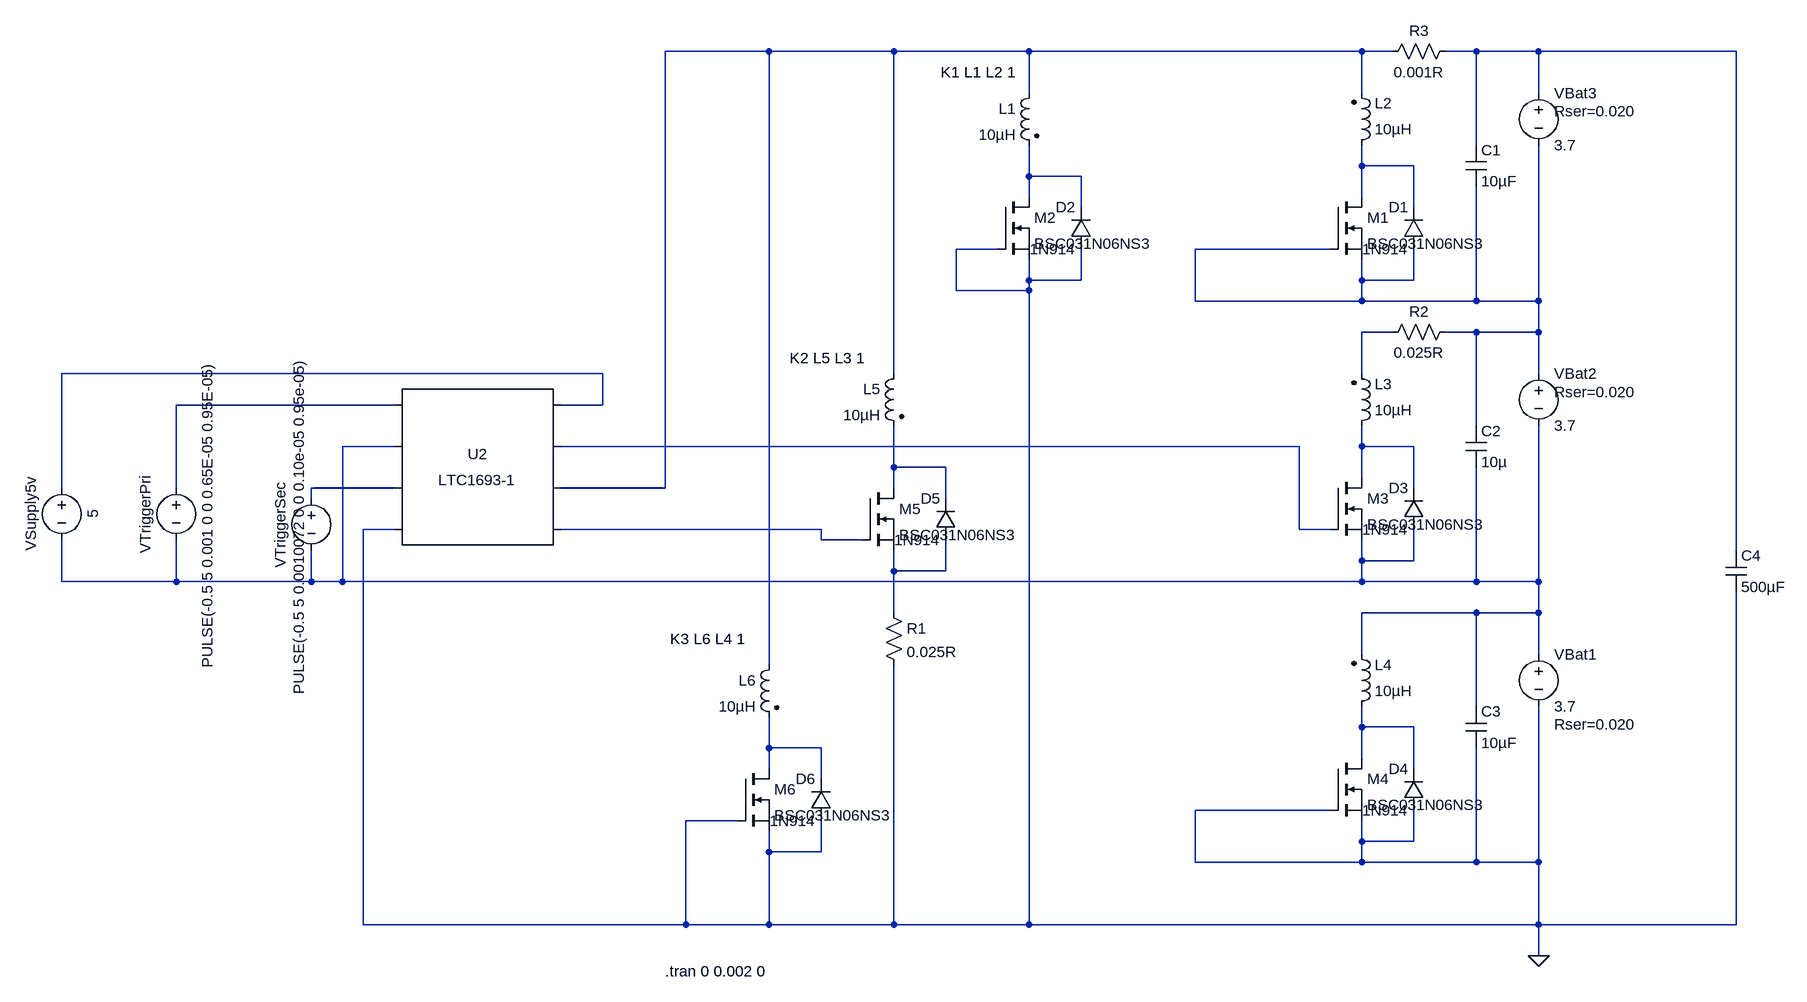
[diagram p0: schematic bms.asc]
bms.asc, the LTspice schematic file:
Version 4
SHEET 1 1480 888
WIRE -768 -672 -928 -672
WIRE -576 -672 -768 -672
WIRE -368 -672 -576 -672
WIRE 144 -672 -368 -672
WIRE 192 -672 144 -672
WIRE 320 -672 272 -672
WIRE 416 -672 320 -672
WIRE 720 -672 416 -672
WIRE -368 -608 -368 -672
WIRE 144 -608 144 -672
WIRE 416 -608 416 -672
WIRE 320 -528 320 -672
WIRE 144 -496 144 -528
WIRE 224 -496 144 -496
WIRE -368 -480 -368 -528
WIRE -288 -480 -368 -480
WIRE -368 -448 -368 -480
WIRE 144 -448 144 -496
WIRE -288 -432 -288 -480
WIRE 224 -432 224 -496
WIRE -416 -368 -480 -368
WIRE 96 -368 -112 -368
WIRE -368 -320 -368 -352
WIRE -288 -320 -288 -368
WIRE -288 -320 -368 -320
WIRE 144 -320 144 -352
WIRE 224 -320 224 -368
WIRE 224 -320 144 -320
WIRE -480 -304 -480 -368
WIRE -368 -304 -368 -320
WIRE -368 -304 -480 -304
WIRE -112 -288 -112 -368
WIRE 144 -288 144 -320
WIRE 144 -288 -112 -288
WIRE 320 -288 320 -464
WIRE 320 -288 144 -288
WIRE 416 -288 416 -528
WIRE 416 -288 320 -288
WIRE 192 -240 144 -240
WIRE 320 -240 272 -240
WIRE 416 -240 416 -288
WIRE 416 -240 320 -240
WIRE -1024 -176 -1856 -176
WIRE -576 -176 -576 -672
WIRE 144 -176 144 -240
WIRE 416 -176 416 -240
WIRE -1344 -128 -1680 -128
WIRE -1024 -128 -1024 -176
WIRE -1024 -128 -1088 -128
WIRE 320 -96 320 -240
WIRE -1344 -64 -1424 -64
WIRE 48 -64 -1088 -64
WIRE 144 -64 144 -96
WIRE 224 -64 144 -64
WIRE -576 -32 -576 -96
WIRE -496 -32 -576 -32
WIRE 144 -16 144 -64
WIRE -1856 0 -1856 -176
WIRE -1680 0 -1680 -128
WIRE -1344 0 -1472 0
WIRE -928 0 -928 -672
WIRE -928 0 -1088 0
WIRE -576 0 -576 -32
WIRE 224 0 224 -64
WIRE -1472 16 -1472 0
WIRE -496 16 -496 -32
WIRE -1344 64 -1392 64
WIRE -688 64 -1088 64
WIRE 48 64 48 -64
WIRE 96 64 48 64
WIRE -688 80 -688 64
WIRE -624 80 -688 80
WIRE 720 96 720 -672
WIRE 144 112 144 80
WIRE 224 112 224 64
WIRE 224 112 144 112
WIRE -576 128 -576 96
WIRE -496 128 -496 80
WIRE -496 128 -576 128
WIRE -1856 144 -1856 80
WIRE -1680 144 -1680 80
WIRE -1680 144 -1856 144
WIRE -1472 144 -1472 96
WIRE -1472 144 -1680 144
WIRE -1424 144 -1424 -64
WIRE -1424 144 -1472 144
WIRE 144 144 144 112
WIRE 144 144 -1424 144
WIRE 320 144 320 -32
WIRE 320 144 144 144
WIRE 416 144 416 -96
WIRE 416 144 320 144
WIRE -576 192 -576 128
WIRE 320 192 144 192
WIRE 416 192 416 144
WIRE 416 192 320 192
WIRE 144 256 144 192
WIRE 416 256 416 192
WIRE -768 272 -768 -672
WIRE 320 336 320 192
WIRE 144 368 144 336
WIRE 224 368 144 368
WIRE -768 400 -768 352
WIRE -688 400 -768 400
WIRE 144 416 144 368
WIRE -768 432 -768 400
WIRE 224 432 224 368
WIRE -688 448 -688 400
WIRE 96 496 -112 496
WIRE -816 512 -896 512
WIRE 144 544 144 512
WIRE 224 544 224 496
WIRE 224 544 144 544
WIRE -768 560 -768 528
WIRE -688 560 -688 512
WIRE -688 560 -768 560
WIRE -112 576 -112 496
WIRE 144 576 144 544
WIRE 144 576 -112 576
WIRE 320 576 320 400
WIRE 320 576 144 576
WIRE 416 576 416 336
WIRE 416 576 320 576
WIRE -1392 672 -1392 64
WIRE -896 672 -896 512
WIRE -896 672 -1392 672
WIRE -768 672 -768 560
WIRE -768 672 -896 672
WIRE -576 672 -576 272
WIRE -576 672 -768 672
WIRE -368 672 -368 -304
WIRE -368 672 -576 672
WIRE 416 672 416 576
WIRE 416 672 -368 672
WIRE 720 672 720 160
WIRE 720 672 416 672
WIRE 416 720 416 672
FLAG 416 720 0
SYMBOL voltage 416 -624 R0
WINDOW 123 0 0 Left 2
WINDOW 39 24 44 Left 2
SYMATTR SpiceLine Rser=0.020
SYMATTR InstName VBat3
SYMATTR Value 3.7
SYMBOL ind2 -352 -624 M0
SYMATTR InstName L1
SYMATTR Value 10µH
SYMATTR Type ind
SYMBOL ind2 128 -512 M180
WINDOW 0 36 80 Left 2
WINDOW 3 36 40 Left 2
SYMATTR InstName L2
SYMATTR Value 10µH
SYMATTR Type ind
SYMBOL nmos 96 -448 R0
SYMATTR InstName M1
SYMATTR Value BSC031N06NS3
SYMBOL diode 240 -368 R180
WINDOW 0 24 64 Left 2
WINDOW 3 24 0 Left 2
SYMATTR InstName D1
SYMATTR Value 1N914
SYMATTR Description Schottky diode
SYMATTR Type schottky
SYMBOL nmos -416 -448 R0
SYMATTR InstName M2
SYMATTR Value BSC031N06NS3
SYMBOL diode -272 -368 R180
WINDOW 0 24 64 Left 2
WINDOW 3 24 0 Left 2
SYMATTR InstName D2
SYMATTR Value 1N914
SYMATTR Description Schottky diode
SYMATTR Type schottky
SYMBOL voltage 416 -192 R0
WINDOW 123 0 0 Left 2
WINDOW 39 24 44 Left 2
SYMATTR SpiceLine Rser=0.020
SYMATTR InstName VBat2
SYMATTR Value 3.7
SYMBOL ind2 128 -80 M180
WINDOW 0 36 80 Left 2
WINDOW 3 36 40 Left 2
SYMATTR InstName L3
SYMATTR Value 10µH
SYMATTR Type ind
SYMBOL nmos 96 -16 R0
SYMATTR InstName M3
SYMATTR Value BSC031N06NS3
SYMBOL diode 240 64 R180
WINDOW 0 24 64 Left 2
WINDOW 3 24 0 Left 2
SYMATTR InstName D3
SYMATTR Value 1N914
SYMATTR Description Schottky diode
SYMATTR Type schottky
SYMBOL voltage 416 240 R0
WINDOW 123 0 0 Left 2
WINDOW 39 24 124 Left 2
SYMATTR SpiceLine Rser=0.020
SYMATTR InstName VBat1
SYMATTR Value 3.7
SYMBOL ind2 128 352 M180
WINDOW 0 36 80 Left 2
WINDOW 3 36 40 Left 2
SYMATTR InstName L4
SYMATTR Value 10µH
SYMATTR Type ind
SYMBOL nmos 96 416 R0
SYMATTR InstName M4
SYMATTR Value BSC031N06NS3
SYMBOL diode 240 496 R180
WINDOW 0 24 64 Left 2
WINDOW 3 24 0 Left 2
SYMATTR InstName D4
SYMATTR Value 1N914
SYMATTR Description Schottky diode
SYMATTR Type schottky
SYMBOL ind2 -560 -192 M0
SYMATTR InstName L5
SYMATTR Value 10µH
SYMATTR Type ind
SYMBOL nmos -624 0 R0
SYMATTR InstName M5
SYMATTR Value BSC031N06NS3
SYMBOL diode -480 80 R180
WINDOW 0 24 64 Left 2
WINDOW 3 24 0 Left 2
SYMATTR InstName D5
SYMATTR Value 1N914
SYMATTR Description Schottky diode
SYMATTR Type schottky
SYMBOL ind2 -752 256 M0
SYMATTR InstName L6
SYMATTR Value 10µH
SYMATTR Type ind
SYMBOL nmos -816 432 R0
SYMATTR InstName M6
SYMATTR Value BSC031N06NS3
SYMBOL diode -672 512 R180
WINDOW 0 24 64 Left 2
WINDOW 3 24 0 Left 2
SYMATTR InstName D6
SYMATTR Value 1N914
SYMATTR Description Schottky diode
SYMATTR Type schottky
SYMBOL cap 304 -528 R0
SYMATTR InstName C1
SYMATTR Value 10µF
SYMBOL cap 304 -96 R0
SYMATTR InstName C2
SYMATTR Value 10µ
SYMATTR SpiceLine V=6.3 Irms=11.832 Rser=0.003 Lser=0
SYMBOL cap 304 336 R0
SYMATTR InstName C3
SYMATTR Value 10µF
SYMBOL voltage -1680 -16 R0
WINDOW 0 -32 56 VBottom 2
WINDOW 3 32 56 VTop 2
WINDOW 123 0 0 Left 2
WINDOW 39 0 0 Left 2
SYMATTR InstName VTriggerPri
SYMATTR Value PULSE(-0.5 5 0.001 0 0 0.65E-05 0.95E-05)
SYMBOL voltage -1472 0 R0
WINDOW 0 -32 56 VBottom 2
WINDOW 3 -4 56 VBottom 2
WINDOW 123 0 0 Left 2
WINDOW 39 0 0 Left 2
SYMATTR InstName VTriggerSec
SYMATTR Value PULSE(-0.5 5 0.0010072 0 0 0.10e-05 0.95e-05)
SYMBOL res -592 176 R0
SYMATTR InstName R1
SYMATTR Value 0.025R
SYMBOL res 288 -256 R90
WINDOW 0 0 56 VBottom 2
WINDOW 3 32 56 VTop 2
SYMATTR InstName R2
SYMATTR Value 0.025R
SYMBOL cap 704 96 R0
SYMATTR InstName C4
SYMATTR Value 500µF
SYMBOL PowerProducts\\LTC1693-1 -1216 -32 R0
SYMATTR InstName U2
SYMBOL voltage -1856 -16 R0
WINDOW 0 -32 56 VBottom 2
WINDOW 3 32 56 VTop 2
WINDOW 123 0 0 Left 2
WINDOW 39 0 0 Left 2
SYMATTR InstName VSupply5v
SYMATTR Value 5
SYMBOL res 176 -656 R270
WINDOW 0 32 56 VTop 2
WINDOW 3 0 56 VBottom 2
SYMATTR InstName R3
SYMATTR Value 0.001R
TEXT -504 -640 Left 2 !K1 L1 L2 1
TEXT -736 -200 Left 2 !K2 L5 L3 1
TEXT -920 232 Left 2 !K3 L6 L4 1
TEXT -928 744 Left 2 !.tran 0 0.002 0

The netlist it stands for:
* bms.asc
VBat3 N002 N005 3.7 Rser=0.020
L1 N001 N004 10µH
L2 N003 N001 10µH
M1 N003 N005 N005 N005 BSC031N06NS3
D1 N005 N003 1N914
M2 N004 0 0 0 BSC031N06NS3
D2 0 N004 1N914
VBat2 N005 N009 3.7 Rser=0.020
L3 N011 N006 10µH
M3 N011 N010 N009 N009 BSC031N06NS3
D3 N009 N011 1N914
VBat1 N009 0 3.7 Rser=0.020
L4 N016 N009 10µH
M4 N016 0 0 0 BSC031N06NS3
D4 0 N016 1N914
L5 N001 N012 10µH
M5 N012 N014 N015 N015 BSC031N06NS3
D5 N015 N012 1N914
L6 N001 N017 10µH
M6 N017 0 0 0 BSC031N06NS3
D6 0 N017 1N914
C1 N002 N005 10µF
C2 N005 N009 10µ V=6.3 Irms=11.832 Rser=0.003 Lser=0
C3 N009 0 10µF
VTriggerPri N008 N009 PULSE(-0.5 5 0.001 0 0 0.65E-05 0.95E-05)
VTriggerSec N013 N009 PULSE(-0.5 5 0.0010072 0 0 0.10e-05 0.95e-05)
R1 N015 0 0.025R
R2 N005 N006 0.025R
C4 N002 0 500µF
XU2 N008 N009 N013 0 N014 N001 N010 N007 LTC1693-1
VSupply5v N007 N009 5
R3 N001 N002 0.001R
.model D D
.lib standard.dio
.model NMOS NMOS
.model PMOS PMOS
.lib standard.mos
K1 L1 L2 1
K2 L5 L3 1
K3 L6 L4 1
.tran 0 0.002 0
.lib LTC1693-1.sub
.backanno
.end